# EasyEDA schematic LcsNodes-Dual-Block-Controller-B.02.00.json

## Sheets
1 Main Controller
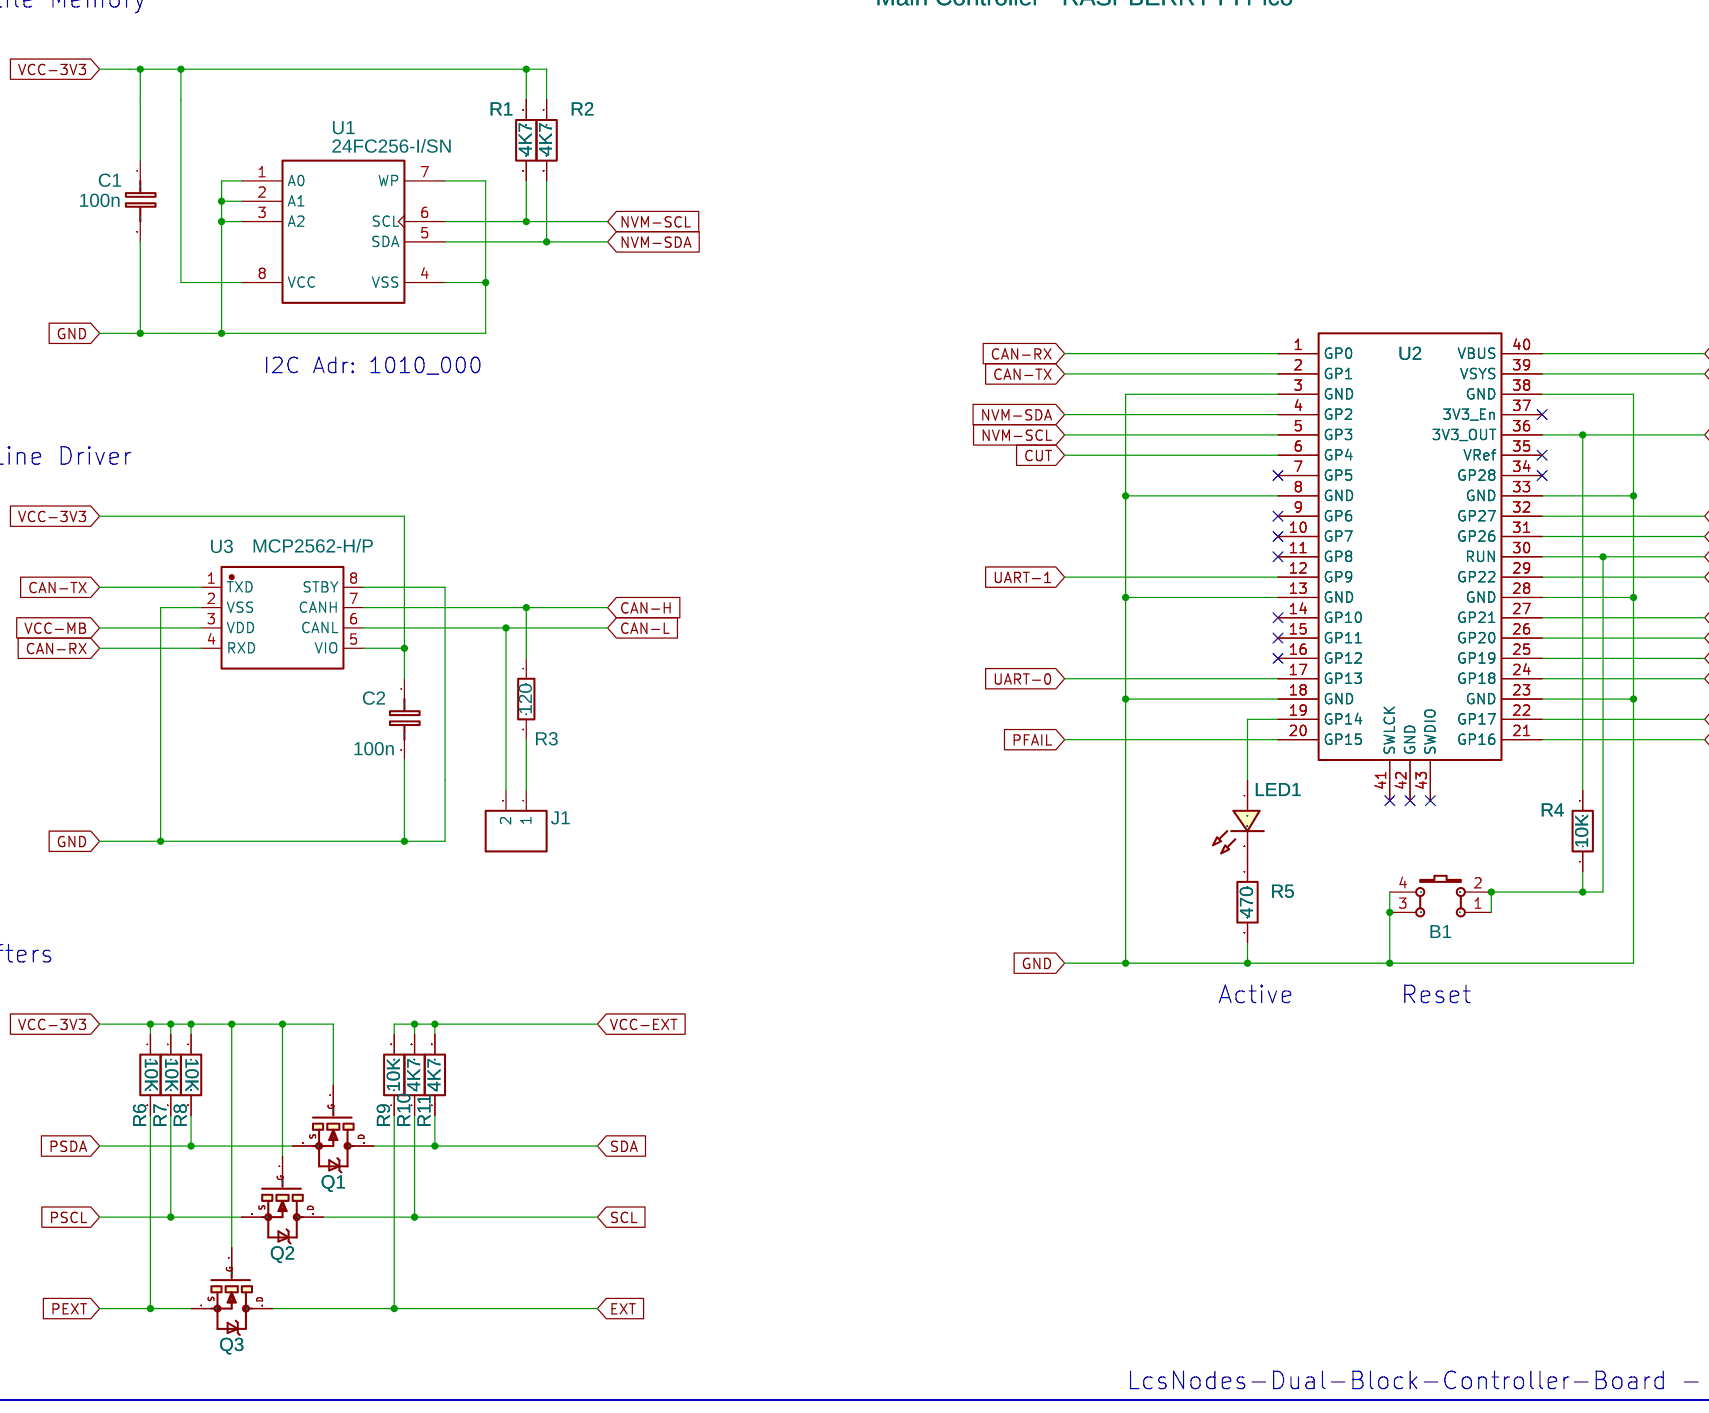
[diagram p0: Main Controller]
2 High Level Schematic
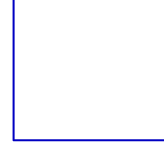
[diagram p1: High Level Schematic]
3 Dual Power Unit
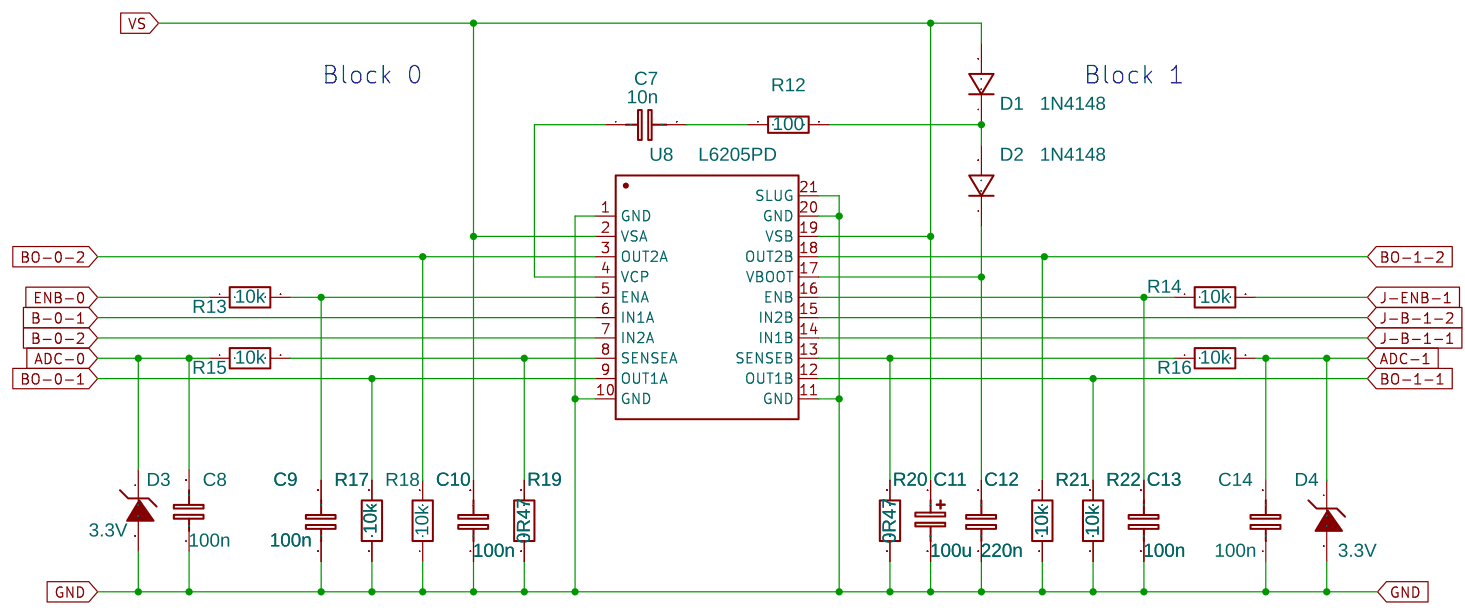
[diagram p2: Dual Power Unit]
4 DCC Signal Input
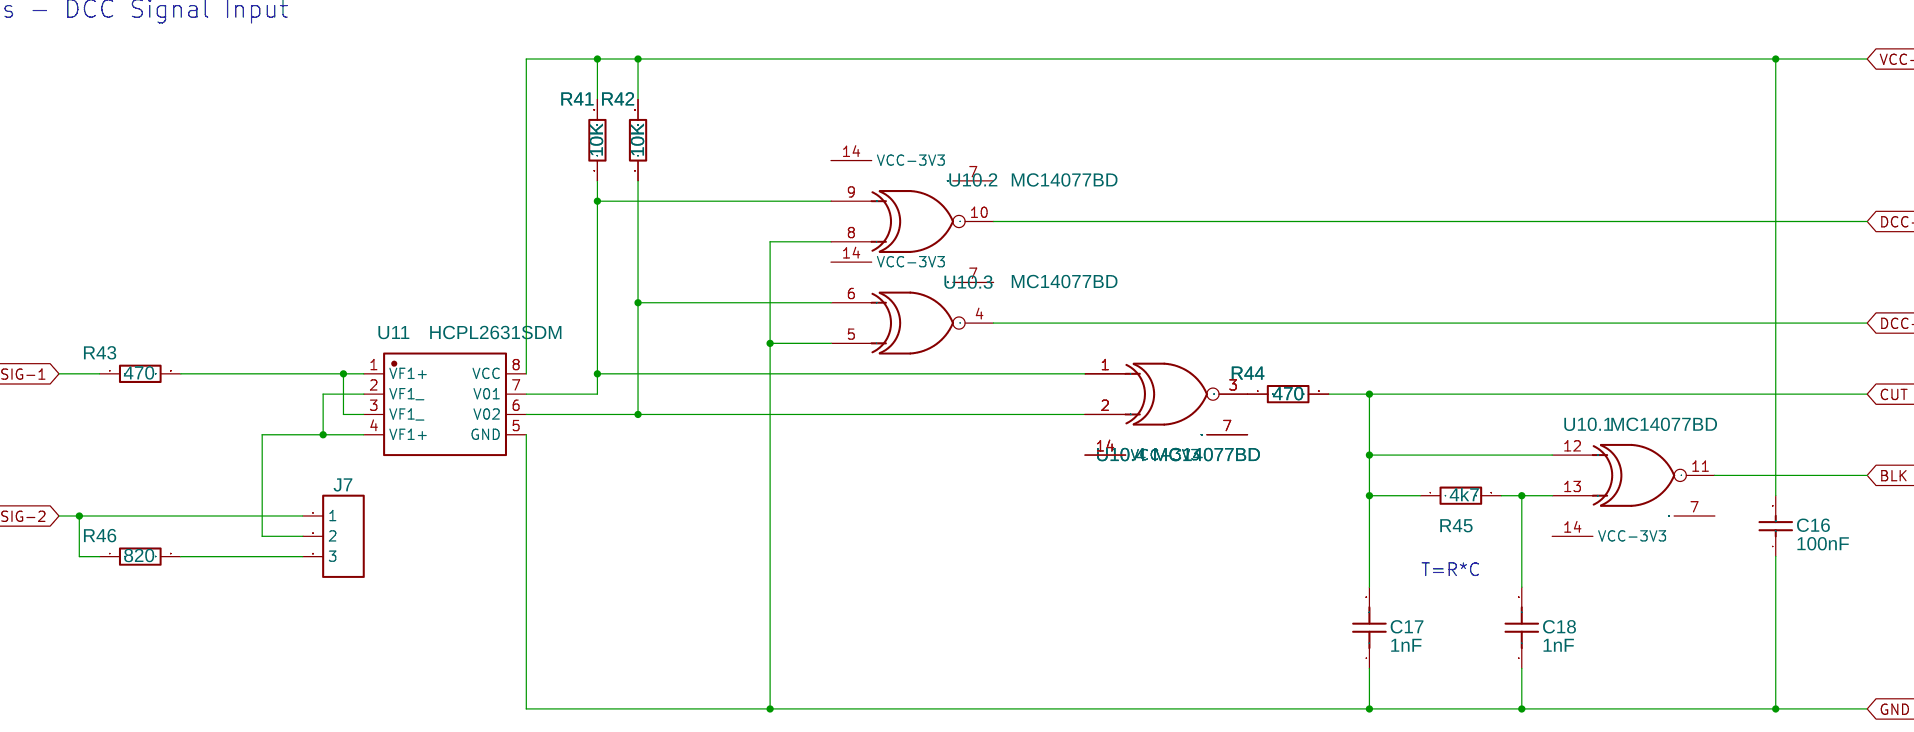
[diagram p3: DCC Signal Input]
5 Power Supply, Connectors
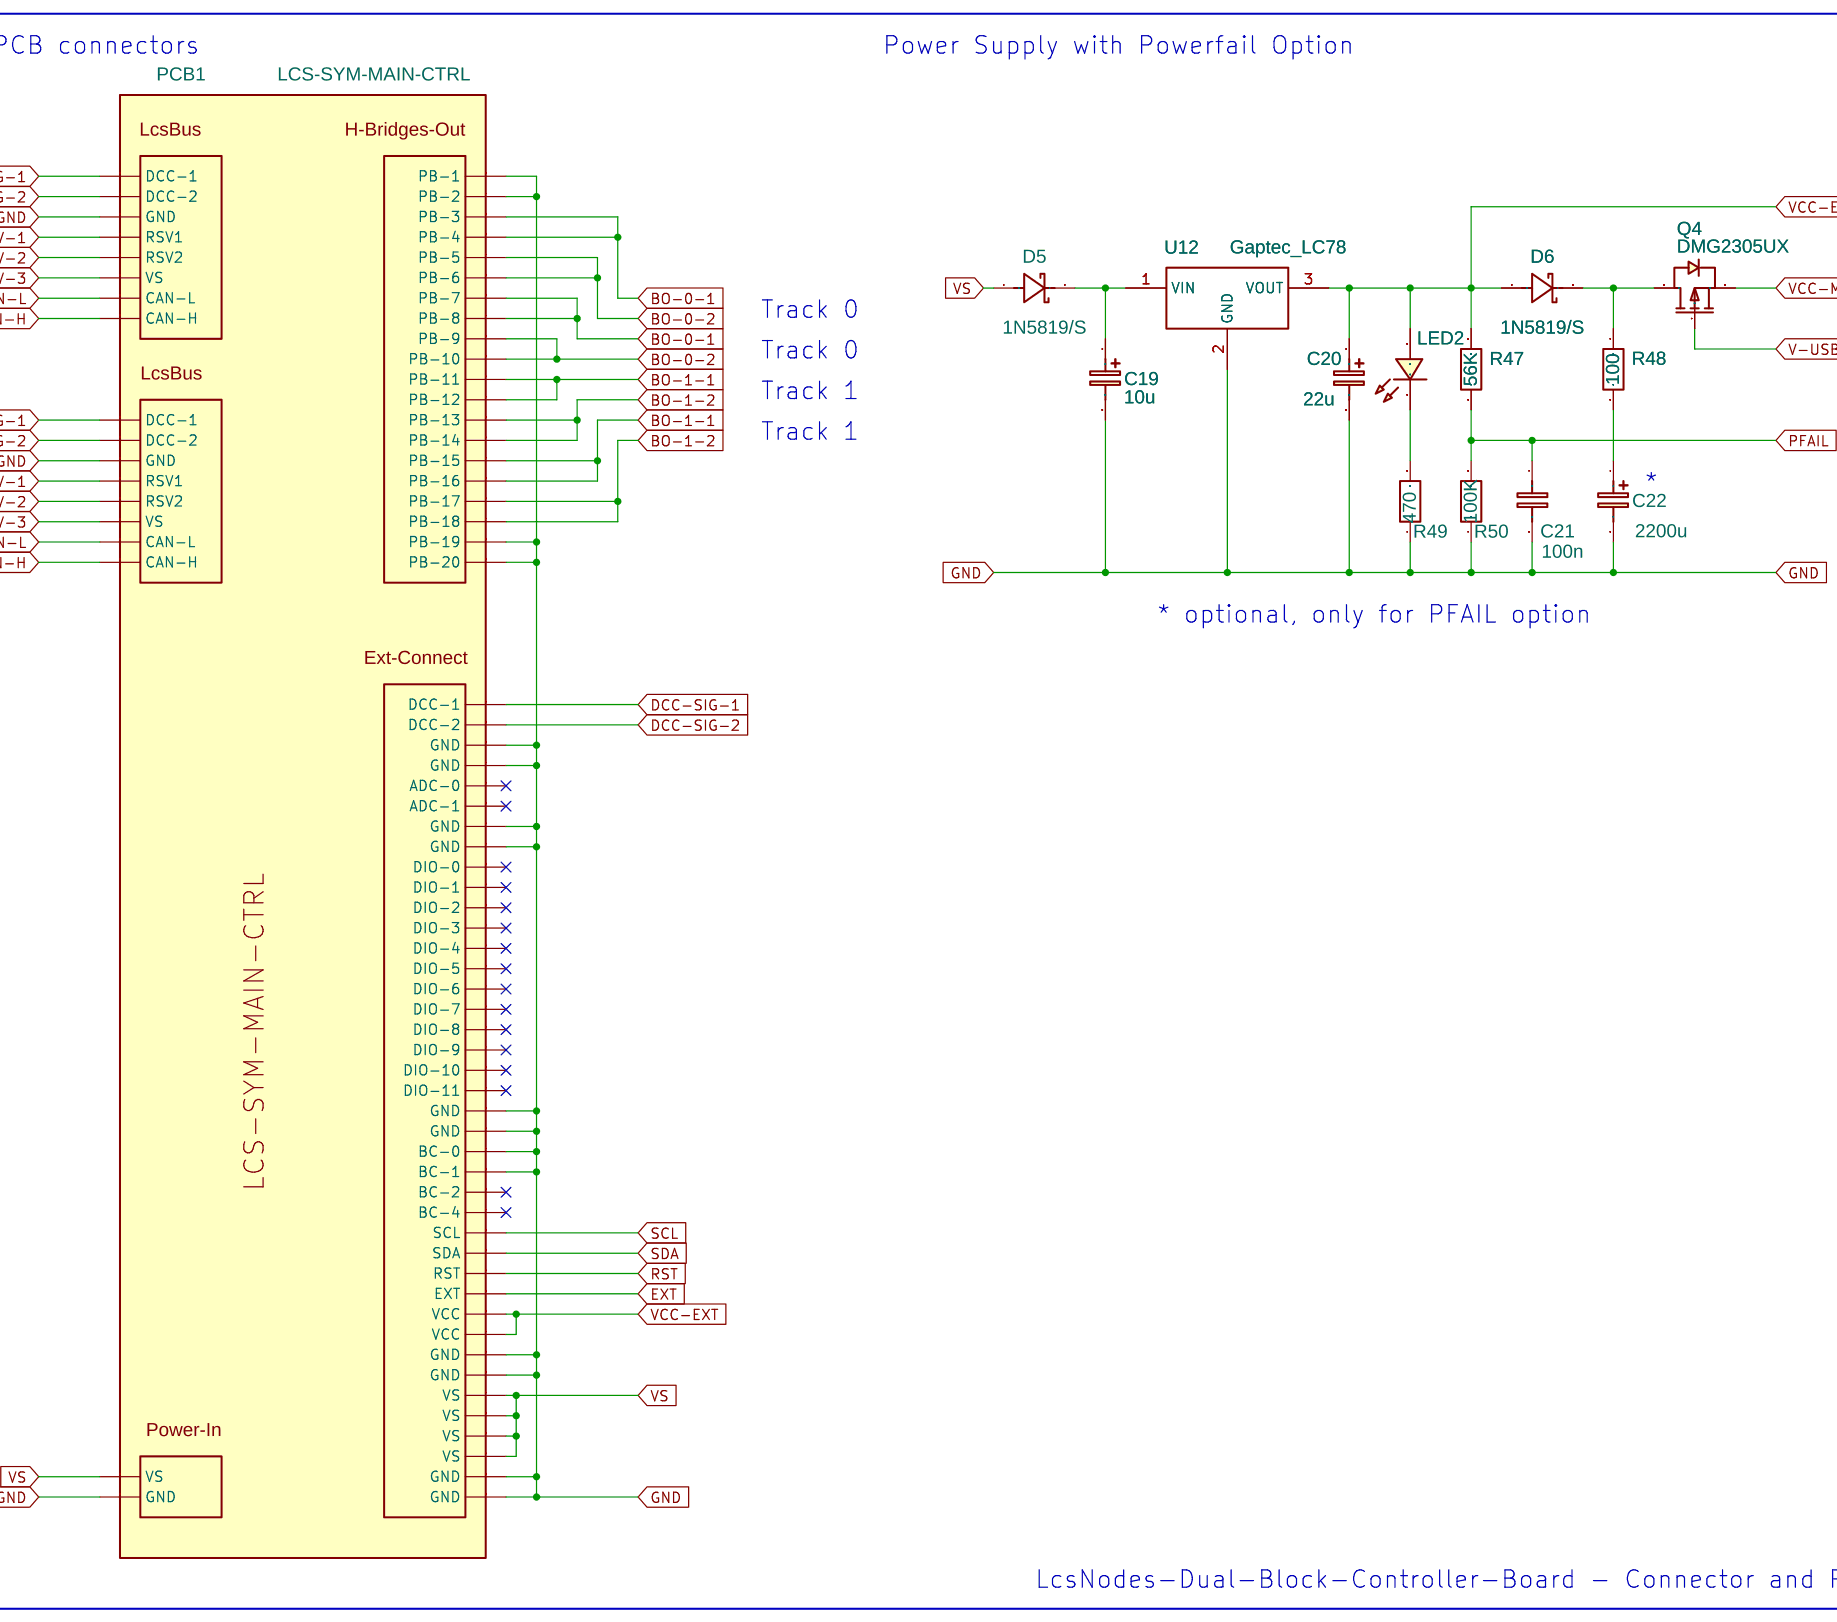
[diagram p4: Power Supply, Connectors]
6 Control Logic
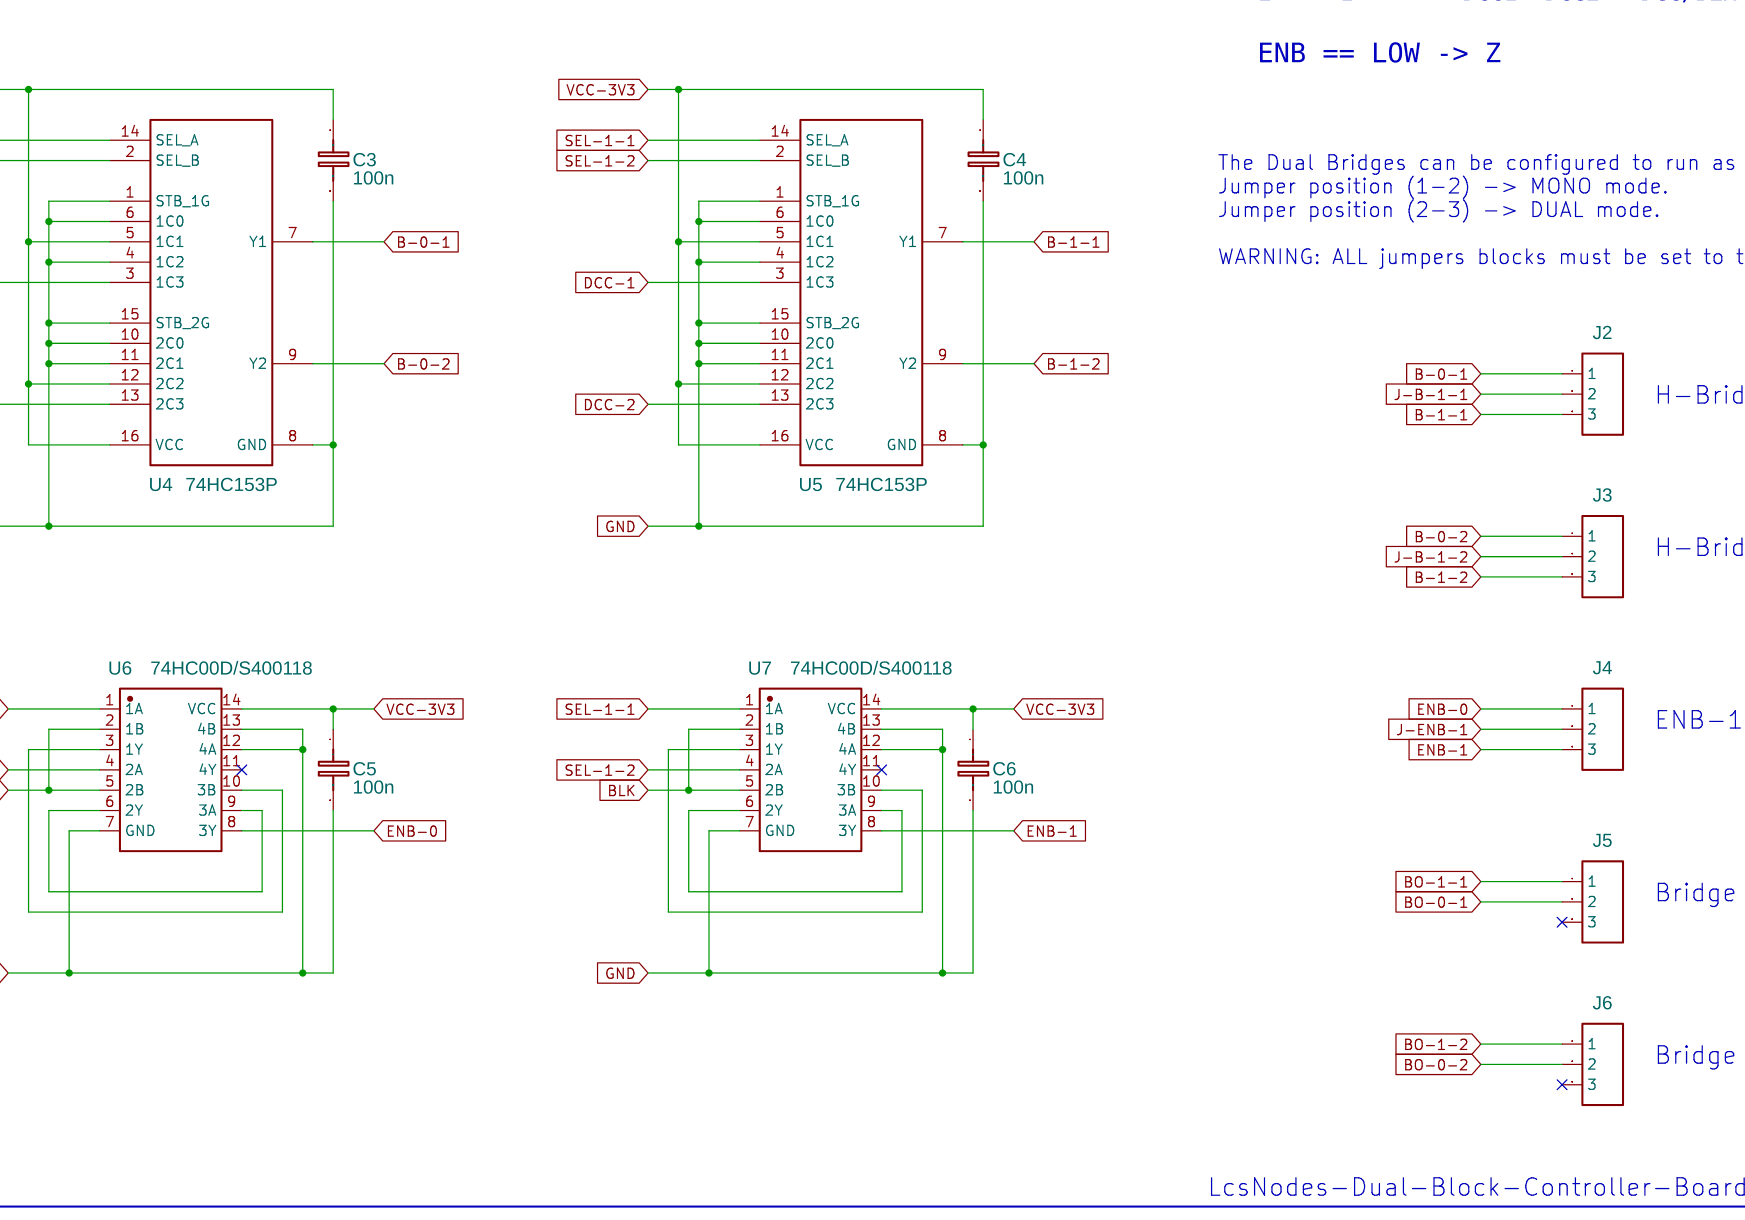
[diagram p5: Control Logic]
7 RailCom Detect
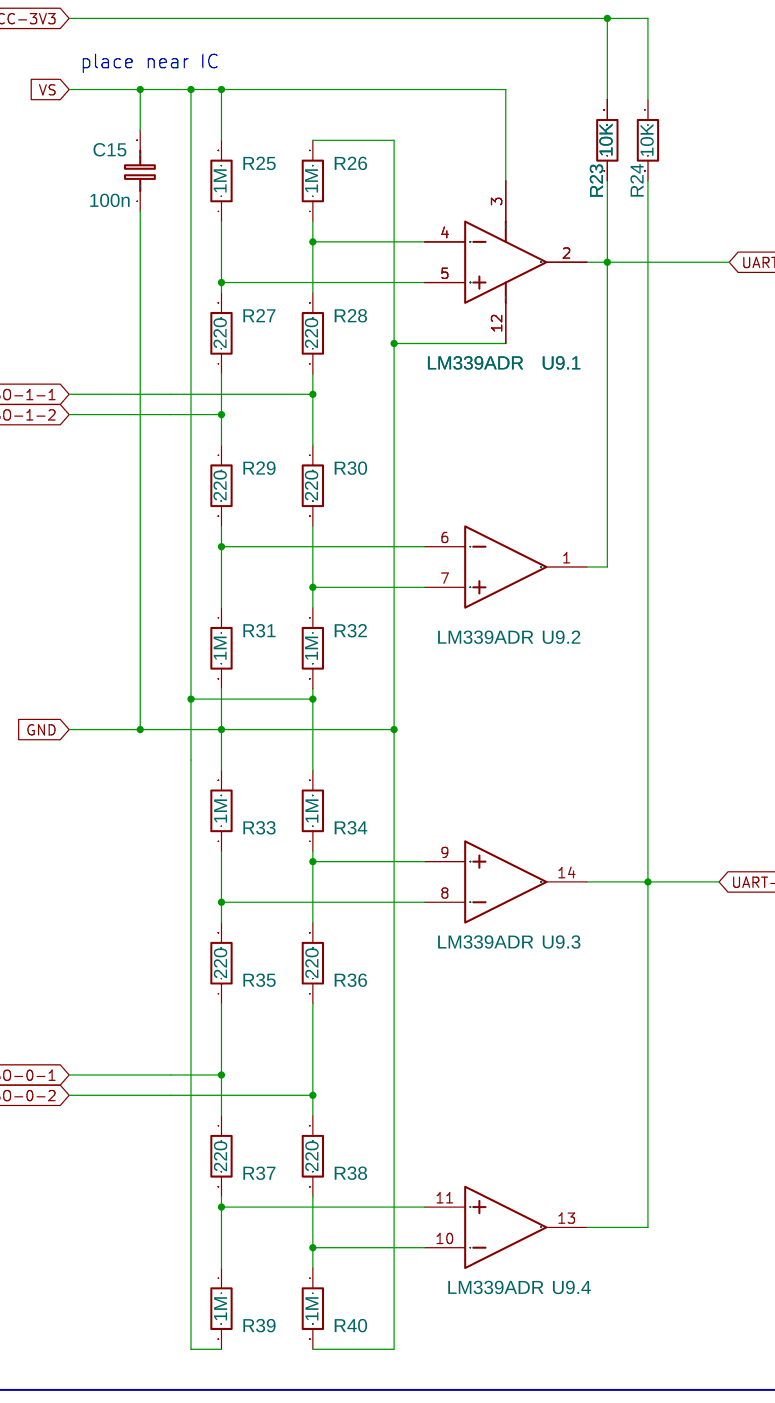
[diagram p6: RailCom Detect]

## Parts
sheet Control Logic
C3  100n  [C1206]
C4  100n  [C1206]
C5  100n  [C1206]
C6  100n  [C1206]
J2  HDR-M-2.54_1x3  [HDR-M-2.54_1X3]
J3  HDR-M-2.54_1x3  [HDR-M-2.54_1X3]
J4  HDR-M-2.54_1x3  [HDR-M-2.54_1X3]
J5  HDR-M-2.54_1x3  [HDR-M-2.54_1X3]
J6  HDR-M-2.54_1x3  [HDR-M-2.54_1X3]
U4  74HC153P  [SO-16_L9.9-W3.9-P1.27-LS6.0-BL]
U5  74HC153P  [SO-16_L9.9-W3.9-P1.27-LS6.0-BL]
U6  74HC00D/S400118  [SO-14_L8.7-W3.9-P1.27-LS6.0-BL]
U7  74HC00D/S400118  [SO-14_L8.7-W3.9-P1.27-LS6.0-BL]
sheet DCC Signal Input
C16  100nF  [C1206]
C17  1nF  [C1206]
C18  1nF  [C1206]
J7  HDR-M-2.54_1x3  [HDR-M-2.54_1X3]
R41  10K  [R1206]
R42  10K  [R1206]
R43  470  [R1206]
R44  470  [R1206]
R45  4k7  [R1206]
R46  820  [R1206]
U10  MC14077BD  [SO-14_L8.7-W3.9-P1.27-LS6.0-BL]  (sections 1,2,3,4)
U11  HCPL2631SDM  [SMT-8_L9.7-W6.6-P2.54-LS10.3-TR]
sheet Dual Power Unit
C7  10n  [C1206]
C8  100n  [C1206]
C9  100n  [C1206]
C10  100n  [C1206]
C11  100u  [CAP-D6.3×H7.7]
C12  220n  [C1206]
C13  100n  [C1206]
C14  100n  [C1206]
D1  1N4148  [SOD-80C_L3.3-W1.5-RD]
D2  1N4148  [SOD-80C_L3.3-W1.5-RD]
D3  3.3V  [SOD-80C_L3.3-W1.5-RD]
D4  3.3V  [SOD-80C_L3.3-W1.5-RD]
R12  100  [R1206]
R13  10k  [R1206]
R14  10k  [R1206]
R15  10k  [R1206]
R16  10k  [R1206]
R17  10k  [R1206]
R18  10k  [R1206]
R19  0R47  [R_AXIAL-0.7]
R20  0R47  [R_AXIAL-0.7]
R21  10k  [R1206]
R22  10k  [R1206]
U8  L6205PD  [POWERSO20_L15.9-W11.0-P1.27-LS14.2-BL-EP]
sheet Main Controller
B1  Opt  [SW-SMD_4P-L6.0-W6.0-P4.50-LS9.0_C23873]
C1  100n  [C1206]
C2  100n  [C1206]
J1  HDR-M-2.54_1x2  [HDR-M-2.54_1X2]
LED1  LED-0805_G  [LED-1206]
Q1  MOSFET-NCHANNELBSS138  [SOT23-3]
Q2  MOSFET-NCHANNELBSS138  [SOT23-3]
Q3  MOSFET-NCHANNELBSS138  [SOT23-3]
R1  4K7  [R1206]
R2  4K7  [R1206]
R3  120  [R1206]
R4  10K  [R1206]
R5  470  [R1206]
R6  10K  [R1206]
R7  10K  [R1206]
R8  10K  [R1206]
R9  10K  [R1206]
R10  4K7  [R1206]
R11  4K7  [R1206]
U1  24FC256-I/SN  [SOIC-8_L4.9-W3.9-P1.27-LS6.0-BL]
U2  Main Controller - RASPBERRY Pi Pico  [RASPBERRY PI PICO]
U3  MCP2562-H/P  [SOIC-8_L4.9-W3.9-P1.27-LS6.1-BL]
sheet Power Supply, Connectors
C19  10u  [CAP-D5.0×H5.5]
C20  22u  [CAP-D5.0×H5.5]
C21  100n  [C1206]
C22  2200u  [CAP-SMD_BD10.0-L10.3-W10.3-LS11.3-FD-1]
D5  1N5819/S  [SMA_L4.3-W2.6-LS5.2-R-RD]
D6  1N5819/S  [SMA_L4.3-W2.6-LS5.2-R-RD]
LED2  LED-0805_G  [LED-1206]
PCB1  LCS-SYM-MAIN-CTRL  [LCS-FP-MAIN-CTRL-10X12]
Q4  DMG2305UX  [SOT-23-3_L2.9-W1.3-P0.95-LS2.4-BR-1]
R47  56K  [R1206]
R48  100  [R1206]
R49  470  [R1206]
R50  100K  [R1206]
U12  Gaptec_LC78  [GAPTEC_LC78]
sheet RailCom Detect
C15  100n  [C1206]
R23  10K  [R1206]
R24  10K  [R1206]
R25  1M  [R1206]
R26  1M  [R1206]
R27  220  [R1206]
R28  220  [R1206]
R29  220  [R1206]
R30  220  [R1206]
R31  1M  [R1206]
R32  1M  [R1206]
R33  1M  [R1206]
R34  1M  [R1206]
R35  220  [R1206]
R36  220  [R1206]
R37  220  [R1206]
R38  220  [R1206]
R39  1M  [R1206]
R40  1M  [R1206]
U9  LM339ADR  [SO-14_L8.6-W3.9-P1.27-LS6.0-BL]  (sections 1,2,3,4)

## Library data of the parts
C1-C6 C15 = C_0603_EU: Contributor: LCEDA_Lib; Package Display: No
J2-J7 = HDR-M-2.54_1x3: Supplier Part: C180248; Supplier: LCSC; Contributor: LCEDA_Lib
U4 U5 = HD74HC153P: Dual 4-to-1 Line Data Selectors  Multiplexers; sourceId: apMfR4kcT
U6 U7 = 74HC00D/S400118: Contributor: lcsc; Supplier: LCSC; Supplier Part: C4471897; Manufacturer: NXP(恩智浦)
C16 = CC1206KKX7R0BB104: Supplier: LCSC; Manufacturer: YAGEO(国巨); Supplier Part: C107181; JLCPCB Part Class: Extended Part; link: https://lcsc.com/eda_search?q=C107181&%26type=1&ref=editor
C17 C18 = CC1206JRNPO9BN102: Contributor: LCSC; Supplier: LCSC; Supplier Part: C113881; Manufacturer: YAGEO(国巨); JLCPCB Part Class: Extended Part; link: https://lcsc.com/eda_search?q=C113881&%26type=1&ref=editor
R41-R43 R46 = SR1206JR-7W4K7L: Contributor: LCSC; Supplier: LCSC; Supplier Part: C326768; Manufacturer: YAGEO(国巨); JLCPCB Part Class: Extended Part; link: https://lcsc.com/eda_search?q=C326768&%26type=1&ref=editor
R44 R45 = 1206W4F1001T5E: Supplier: LCSC; Manufacturer: UNI-ROYAL(厚声); Supplier Part: C4410; JLCPCB Part Class: Basic Part; link: https://lcsc.com/eda_search?q=C4410&%26type=1&ref=editor
U10 = MC14077BD: Quad XNOR Gate; subpart_no: 1; Package Display: No
U11 = HCPL2631SDM: Contributor: LCSC; Supplier: LCSC; Supplier Part: C899529; Manufacturer: onsemi(安森美); JLCPCB Part Class: Extended Part
C7-C10 C12-C14 = C_0603_EU: Contributor: LCEDA_Lib
C11 C19 C20 = CE_SMD_D5.0×H5.5_EU: Contributor: LCEDA_Lib
D1 D2 = 1N4148: Supplier: LCSC; Manufacturer: SEMTECH; Supplier Part: C14516; Contributor: LCEDA_Lib
D3 D4 = Diode Zener: Supplier: LCSC; Manufacturer: SEMTECH; Supplier Part: C14516; JLCPCB Part Class: Extended Part; Contributor: Arrost
R3 R12 = RESISTOR-AXIAL-0.1
R13-R18 R21-R40 R47-R50 = R_AXIAL-0.3_EU: Contributor: LCEDA_Lib
R19 R20 = R_AXIAL-0.5_EU: Contributor: LCEDA_Lib
U8 = L6205PD: Supplier: LCSC; Manufacturer: ST(意法半导体); Manufacturer Part: L6205PD013TR; Supplier Part: C36543; JLCPCB Part Class: Extended Part
B1 = K4-6×6_TH: Supplier: LCSC; Supplier Part: C136684; Manufacturer: 韩国韩荣; Manufacturer Part: K2-1102DP-E4SW-04; Contributor: LCEDA_Lib; Package Display: No
J1 = HDR-M-2.54_1x2: Supplier Part: C124375; Supplier: LCSC; Contributor: LCEDA_Lib
LED1 LED2 = LED-0805_G: Manufacturer: 国星光电; Manufacturer Part: NCD0805G1; Supplier Part: C84260; Contributor: LCEDA_Lib
Q1-Q3 = MOSFET-NCHANNELBSS138: Common NMOSFET Parts; Contributor: SparkFun
R1 R2 R4-R11 = R_0805_EU: Contributor: LCEDA_Lib
U1 = 24FC256-I/SN: Supplier: LCSC; Manufacturer: MICROCHIP(美国微芯); Contributor: LCSC; Supplier Part: C145385; JLCPCB Part Class: Extended Part
U2 = RASPBERRY Pi Pico Through Holes: Contributor: untung91
U3 = MCP2562-H/P: Supplier: LCSC; Supplier Part: C640348; Manufacturer: MICROCHIP(美国微芯); link: https://atta.szlcsc.comnull; Contributor: lcsc
C21 = C_RAD-0.2_EU: Contributor: LCEDA_Lib
C22 = C_Tan_SMD_A_EU: Contributor: LCEDA_Lib
D5 D6 = 1N5819/S: Supplier: LCSC; Supplier Part: C9900003833; JLCPCB Part Class: Extended Part; Contributor: LCSC
PCB1 = LCS-SYM-MAIN-CTRL: Contributor: helmut-f
Q4 = DMG2305UX: Supplier: LCSC; Supplier Part: C2940629; Manufacturer: TECH PUBLIC(台舟); link: https://atta.szlcsc.com//upload/public/pdf/source/20220124/672A40BC72F4DE27873D6595D2E3AF1A.pdf; Contributor: LCSC; JLCPCB Part Class: Extended Part
U12 = Gaptec_LC78: Contributor: SpicyMemeBoi; Package Display: No
U9 = LM339ADR: Supplier Part: C74559; Supplier: LCSC; Manufacturer Part: TI; subpart_no: 1; JLCPCB Part Class: Extended Part

## Nets
GND: B1.3 B1.4 C1.2 C2.2 C3.2 C4.2 C5.2 C6.2 C8.1 C9.1 C10.1 C11.2 C12.1 C13.1 C14.1 C15.1 C16.1 C17.1 C18.1 C19.2 C20.2 C21.2 C22.2 D3.2(A) D4.2(A) PCB1.3(GND) PCB1.13(GND) PCB1.21(GND) PCB1.30(PB-1) PCB1.31(PB-2) PCB1.48(PB-19) PCB1.49(PB-20) PCB1.62(GND) PCB1.63(GND) PCB1.66(GND) PCB1.67(GND) PCB1.80(GND) PCB1.81(GND) PCB1.82(BC-0) PCB1.83(BC-1) PCB1.92(GND) PCB1.93(GND) PCB1.98(GND) PCB1.99(GND) R5.2 R17.1 R18.1 R19.1 R20.1 R21.1 R22.1 R26.2 R31.2 R33.2 R40.2 R49.1 R50.1 U1.1(A0) U1.2(A1) U1.3(A2) U1.4(VSS) U1.7(WP) U2.3(GND) U2.8(GND) U2.13(GND) U2.18(GND) U2.23(GND) U2.28(GND) U2.33(GND) U2.38(GND) U3.2(VSS) U3.8(STBY) U4.1(STB 1G) U4.4(1C2) U4.6(1C0) U4.8(GND) U4.10(2C0) U4.11(2C1) U4.15(STB 2G) U5.1(STB 1G) U5.4(1C2) U5.6(1C0) U5.8(GND) U5.10(2C0) U5.11(2C1) U5.15(STB 2G) U6.7(GND) U6.12(4A) U6.13(4B) U7.7(GND) U7.12(4A) U7.13(4B) U8.1(GND) U8.10(GND) U8.11(GND) U8.20(GND) U8.21(SLUG) U9.12(GND) U10.5(A) U10.8(A) U11.5(GND) U12.2(GND)
VCC-3V3: C1.1 C2.1 C3.1 C4.1 C5.1 C6.1 C16.2 Q1.1(G) Q2.1(G) Q3.1(G) R1.1 R2.1 R4.2 R6.1 R7.1 R8.1 R23.2 R24.1 R41.2 R42.2 U1.8(VCC) U2.36(3V3_OUT) U3.5(VIO) U4.5(1C1) U4.12(2C2) U4.16(VCC) U5.5(1C1) U5.12(2C2) U5.16(VCC) U6.14(VCC) U7.14(VCC) U11.8(VCC)
VCC-EXT: C20.1 D6.1(A) LED2.1 PCB1.90(VCC) PCB1.91(VCC) R9.2 R10.2 R11.2 R47.2 U12.3(VOUT)
VCC-MB: Q4.2(S) U2.39(VSYS) U3.3(VDD)
ADC-0: C8.2 D3.1(C) R15.1 U2.31(GP26)
ADC-1: C14.2 D4.1(C) R16.2 U2.32(GP27)
B-0-1: J2.1 U4.7(Y1) U8.6(IN1A)
B-0-2: J3.1 U4.9(Y2) U8.7(IN2A)
B-1-1: J2.3 U5.7(Y1)
B-1-2: J3.3 U5.9(Y2)
BLK: U6.2(1B) U6.5(2B) U7.2(1B) U7.5(2B) U10.11(Y)
BO-0-1: J5.2 PCB1.32(PB-3) PCB1.33(PB-4) PCB1.36(PB-7) PCB1.37(PB-8) R17.2 R35.1 R37.1 U8.9(OUT1A)
BO-0-2: J6.2 PCB1.34(PB-5) PCB1.35(PB-6) PCB1.38(PB-9) PCB1.39(PB-10) R18.2 R36.1 R38.1 U8.3(OUT2A)
BO-1-1: J5.1 PCB1.40(PB-11) PCB1.41(PB-12) PCB1.44(PB-15) PCB1.45(PB-16) R22.2 R28.1 R30.1 U8.12(OUT1B)
BO-1-2: J6.1 PCB1.42(PB-13) PCB1.43(PB-14) PCB1.46(PB-17) PCB1.47(PB-18) R21.2 R27.1 R29.1 U8.18(OUT2B)
CAN-H: PCB1.8(CAN-H) PCB1.18(CAN-H) R3.1 U3.7(CANH)
CAN-L: J1.2 PCB1.7(CAN-L) PCB1.17(CAN-L) U3.6(CANL)
CAN-RX: U2.1(GP0) U3.4(RXD)
CAN-TX: U2.2(GP1) U3.1(TXD)
CUT: C17.2 R44.2 R45.1 U2.6(GP4) U10.12(A)
DCC-1: U4.3(1C3) U5.3(1C3) U10.10(Y)
DCC-2: U4.13(2C3) U5.13(2C3) U10.4(Y)
DCC-SIG-1: PCB1.1(DCC-1) PCB1.11(DCC-1) PCB1.60(DCC-1) R43.1
DCC-SIG-2: J7.1 PCB1.2(DCC-2) PCB1.12(DCC-2) PCB1.61(DCC-2) R46.1
ENB-0: J4.1 R13.1 U6.8(3Y)
ENB-1: J4.3 U7.8(3Y)
EXT: PCB1.89(EXT) Q3.3(D) R9.1
J-B-1-1: J2.2 U8.14(IN1B)
J-B-1-2: J3.2 U8.15(IN2B)
J-ENB-1: J4.2 R14.2
NVM-SCL: R1.2 U1.6(SCL) U2.5(GP3)
NVM-SDA: R2.2 U1.5(SDA) U2.4(GP2)
PEXT: Q3.2(S) R6.2 U2.29(GP22)
PFAIL: C21.1 R47.1 R50.2 U2.20(GP15)
PSCL: Q2.2(S) R7.2 U2.22(GP17)
PSDA: Q1.2(S) R8.2 U2.21(GP16)
RST: B1.1 B1.2 PCB1.88(RST) R4.1 U2.30(RUN)
RSV-1: PCB1.4(RSV1) PCB1.14(RSV1)
RSV-2: PCB1.5(RSV2) PCB1.15(RSV2)
RSV-3: PCB1.6(VS) PCB1.16(VS)
SCL: PCB1.86(SCL) Q2.3(D) R10.1
SDA: PCB1.87(SDA) Q1.3(D) R11.1
SEL-0-1: U2.27(GP21) U4.14(SEL A) U6.1(1A)
SEL-0-2: U2.26(GP20) U4.2(SEL B) U6.4(2A)
SEL-1-1: U2.25(GP19) U5.14(SEL A) U7.1(1A)
SEL-1-2: U2.24(GP18) U5.2(SEL B) U7.4(2A)
UART-0: R24.2 U2.17(GP13) U9.13(OUT4) U9.14(OUT3)
UART-1: R23.1 U2.12(GP9) U9.1(OUT1) U9.2(OUT2)
V-USB: Q4.1(G) U2.40(VBUS)
VS: C10.2 C11.1 C15.2 D1.2(1) D5.1(A) PCB1.20(VS) PCB1.94(VS) PCB1.95(VS) PCB1.96(VS) PCB1.97(VS) R25.2 R32.2 R34.2 R39.2 U8.2(VSA) U8.19(VSB) U9.3(VCC)
Net-(C7-1): C7.1 U8.4(VCP)
Net-(C7-2): C7.2 R12.1
Net-(C9-2): C9.2 R13.2 U8.5(ENA)
Net-(C12-2): C12.2 D2.1(2) U8.17(VBOOT)
Net-(C13-2): C13.2 R14.1 U8.16(ENB)
Net-(C18-2): C18.2 R45.2 U10.13(B)
Net-(C19-1): C19.1 D5.2(K) U12.1(VIN)
Net-(C22-1): C22.1 R48.2
Net-(D1-1): D1.1(2) D2.2(1) R12.2
Net-(D6-2): D6.2(K) Q4.3(D) R48.1
Net-(J1-1): J1.1 R3.2
Net-(J7-2): J7.2 U11.2(VF1_) U11.4(VF1+)
Net-(J7-3): J7.3 R46.2
Net-(LED1-1): LED1.1 U2.19(GP14)
Net-(LED1-2): LED1.2 R5.1
Net-(LED2-2): LED2.2 R49.2
Net-(R15-2): R15.2 R19.2 U8.8(SENSEA)
Net-(R16-1): R16.1 R20.2 U8.13(SENSEB)
Net-(R25-1): R25.1 R27.2 U9.5(IN2+)
Net-(R26-1): R26.1 R28.2 U9.4(IN2-)
Net-(R29-2): R29.2 R31.1 U9.6(IN1-)
Net-(R30-2): R30.2 R32.1 U9.7(IN1+)
Net-(R33-1): R33.1 R35.2 U9.8(IN3-)
Net-(R34-1): R34.1 R36.2 U9.9(IN3+)
Net-(R37-2): R37.2 R39.1 U9.11(IN4+)
Net-(R38-2): R38.2 R40.1 U9.10(IN4-)
Net-(R41-1): R41.1 U10.1(A) U10.9(B) U11.7(V01)
Net-(R42-1): R42.1 U10.2(B) U10.6(B) U11.6(V02)
Net-(R43-2): R43.2 U11.1(VF1+) U11.3(VF1_)
Net-(R44-1): R44.1 U10.3(Y)
Net-(U6-3): U6.3(1Y) U6.10(3B)
Net-(U6-6): U6.6(2Y) U6.9(3A)
Net-(U7-3): U7.3(1Y) U7.10(3B)
Net-(U7-6): U7.6(2Y) U7.9(3A)

Not connected (* = marked no-connect by the designer): J5 3*; J6 3*; PCB1 64(ADC-0)* 65(ADC-1)* 68(DIO-0)* 69(DIO-1)* 70(DIO-2)* 71(DIO-3)* 72(DIO-4)* 73(DIO-5)* 74(DIO-6)* 75(DIO-7)* 76(DIO-8)* 77(DIO-9)* 78(DIO-10)* 79(DIO-11)* 84(BC-2)* 85(BC-4)*; U2 7(GP5)* 9(GP6)* 10(GP7)* 11(GP8)* 14(GP10)* 15(GP11)* 16(GP12)* 34(GP28)* 35(VRef)* 37(3V3_En)* 41(SWLCK)* 42(GND)* 43(SWDIO)*; U6 11(4Y)*; U7 11(4Y)*; U10 7(GND) 14(VCC-3V3)

## Notes on the sheets
sheet 1
- Non-Volatile Memory
- I2C Adr: 1010_000
- CAN Bus Line Driver
- Level shifters
- Active
- Reset
- LcsNodes-Dual-Block-Controller-Board - Main Controller - Page 2 of 7
sheet 2
- DCC Signal Detect
  Control Logic
- Cutout
- Disable
- H-Bridge
- RC
  detector
- CAN
  Driver
- B-Ctrl-0
- B-Power
  Meas-0
- LCS Bus Connector
- Analog
  Input/Select
- Analog
  OpAmp
- RC-In-0
- Track Connector
- Select
- NVM
  Memory
- I2C
- coupling
- Bridge-Control
- B-Ctrl-1
- B-Power
  Meas-1
- H-Bridge
- RC
  detector
- RC-In-1
- Raspberry PI
  PICO
- Analog
  OpAmp
- Serial In
- RC
- Control Logic
- I2C
  extern
- Power Supply
- Extension Connector
- Power
- LcsNodes-Dual-Block-Controller-Board - Block Diagram - Page 1 of 7
sheet 3
- Dual H-Bridge
- Block 0
- Block 1
- LcsNodes-Dual-Block-Controller-Board - Dual Power Unit - Page 4 of 7
sheet 4
- LCS Bus - DCC Signal Input
- T=R*C
- DCC Signal, Cutout and Block Signal.
- +
- DCC Input:
  00->CUTOUT
  01->DCC+
  10->DCC-
- DCC
- Cutout Period
- -
- CUT
- 0
- BLK
- 0
- LcsNodes-Dual-Block-Controller-Board - DCC Signal Input - Page 6 of 7
sheet 5
- Block Controller PCB connectors
- Power Supply with Powerfail Option
- Track 0
- Track 0
- Track 1
- Track 1
- *
- * optional, only for PFAIL option
- LcsNodes-Dual-Block-Controller-Board - Connector and Power - Page 7 of 7
sheet 6
- H-Bridge Control Logic
- Control Logic Signals:
  Sel-2 Sel-1 -> B-x-1 B-x-2  ENB-x  STATE
  0     0     -> GND   GND    GND        "Z"
  0     1     -> VCC   GND    PWM/BLK    "FWD"
  1     0     -> GND   VCC    PWM/BLK    "REV"
  1     1     -> DCC1  DCC2   DCC/BLK    "DCC"
- ENB == LOW -> Z
- The Dual Bridges can be configured to run as a Mono Block.
  Jumper position (1-2) -> MONO mode.
  Jumper position (2-3) -> DUAL mode.
  WARNING: ALL jumpers blocks must be set to the correct option.
- H-Bridge 1-1 Selection
- H-Bridge 1-2 Selection
- ENB-1 Selection
- Bridge Paralell Mode
- Bridge Paralell Mode
- LcsNodes-Dual-Block-Controller-Board - Bridge-Control - Page 3 of 7
sheet 7
- Dual RailCom Detector
- place near IC
- LcsNodes-Dual-Block-Controller-Board - RailCom Detect - Page 5 of 7
